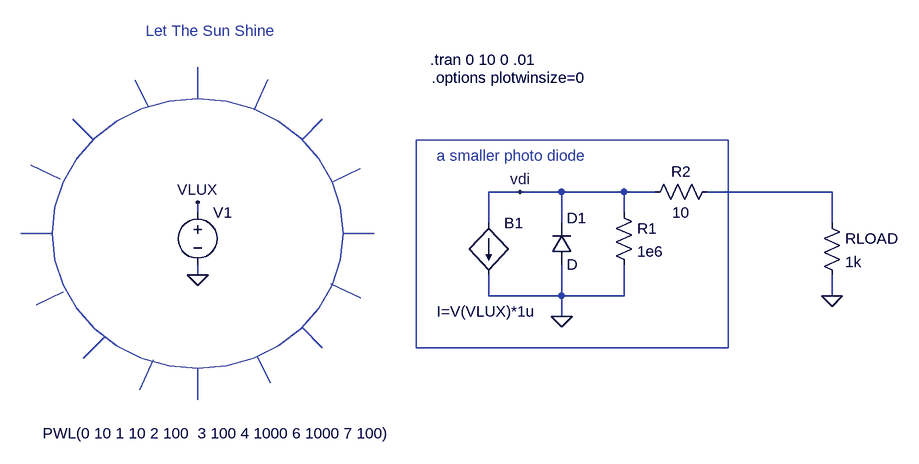
[diagram p0: schematic let_the_sun_shine.asc]
let_the_sun_shine.asc, the LTspice schematic file:
Version 4
SHEET 1 964 680
WIRE 368 128 320 128
WIRE 432 128 368 128
WIRE 528 128 432 128
WIRE 576 128 528 128
WIRE 848 128 656 128
WIRE -128 160 -128 144
WIRE 528 160 528 128
WIRE 320 176 320 128
WIRE 432 176 432 128
WIRE 848 176 848 128
WIRE -128 256 -128 240
WIRE 320 288 320 256
WIRE 432 288 432 240
WIRE 432 288 320 288
WIRE 528 288 528 240
WIRE 528 288 432 288
WIRE 848 288 848 256
WIRE 432 320 432 288
FLAG 432 320 0
FLAG 368 128 vdi
FLAG 848 288 0
FLAG -128 144 VLUX
FLAG -128 256 0
SYMBOL diode 416 240 M180
WINDOW 0 24 72 Left 0
WINDOW 3 24 0 Left 0
SYMATTR InstName D1
SYMBOL res 512 144 R0
SYMATTR InstName R1
SYMATTR Value 1e6
SYMBOL res 560 144 R270
WINDOW 0 32 56 VTop 0
WINDOW 3 0 56 VBottom 0
SYMATTR InstName R2
SYMATTR Value 10
SYMBOL bi 320 176 R0
WINDOW 3 -80 136 Left 0
SYMATTR InstName B1
SYMATTR Value I=V(VLUX)*1u
SYMBOL res 832 160 R0
SYMATTR InstName RLOAD
SYMATTR Value 1k
SYMBOL voltage -128 144 R0
WINDOW 3 -238 356 Left 0
WINDOW 123 0 0 Left 0
WINDOW 39 0 0 Left 0
SYMATTR InstName V1
SYMATTR Value PWL(0 10 1 10 2 100  3 100 4 1000 6 1000 7 100)
TEXT 230 -76 Left 0 !.tran 0 10 0 .01
TEXT 240 72 Left 0 ;a smaller photo diode
TEXT 232 -48 Left 0 !.options plotwinsize=0
TEXT -208 -120 Left 0 ;Let The Sun Shine
LINE Normal -128 -64 -128 -16
LINE Normal -352 192 -400 192
LINE Normal -128 400 -128 448
LINE Normal 144 192 96 192
LINE Normal -335 282 -376 302
LINE Normal -272 352 -304 384
LINE Normal 64 16 32 48
LINE Normal 64 368 32 336
LINE Normal -288 48 -320 16
LINE Normal 122 92 81 112
LINE Normal -204 -3 -224 -44
LINE Normal -16 422 -36 381
LINE Normal -196 387 -217 433
LINE Normal -20 -45 -41 1
LINE Normal -339 108 -385 87
LINE Normal 123 291 77 270
RECTANGLE Normal 688 368 208 48
CIRCLE Normal 96 400 -352 -16

The netlist it stands for:
* let_the_sun_shine.asc
D1 0 vdi D
R1 vdi 0 1e6
R2 vdi N001 10
B1 vdi 0 I=V(VLUX)*1u
RLOAD N001 0 1k
V1 VLUX 0 PWL(0 10 1 10 2 100  3 100 4 1000 6 1000 7 100)
.model D D
.lib standard.dio
.tran 0 10 0 .01
* a smaller photo diode
.options plotwinsize=0
* Let The Sun Shine
.backanno
.end